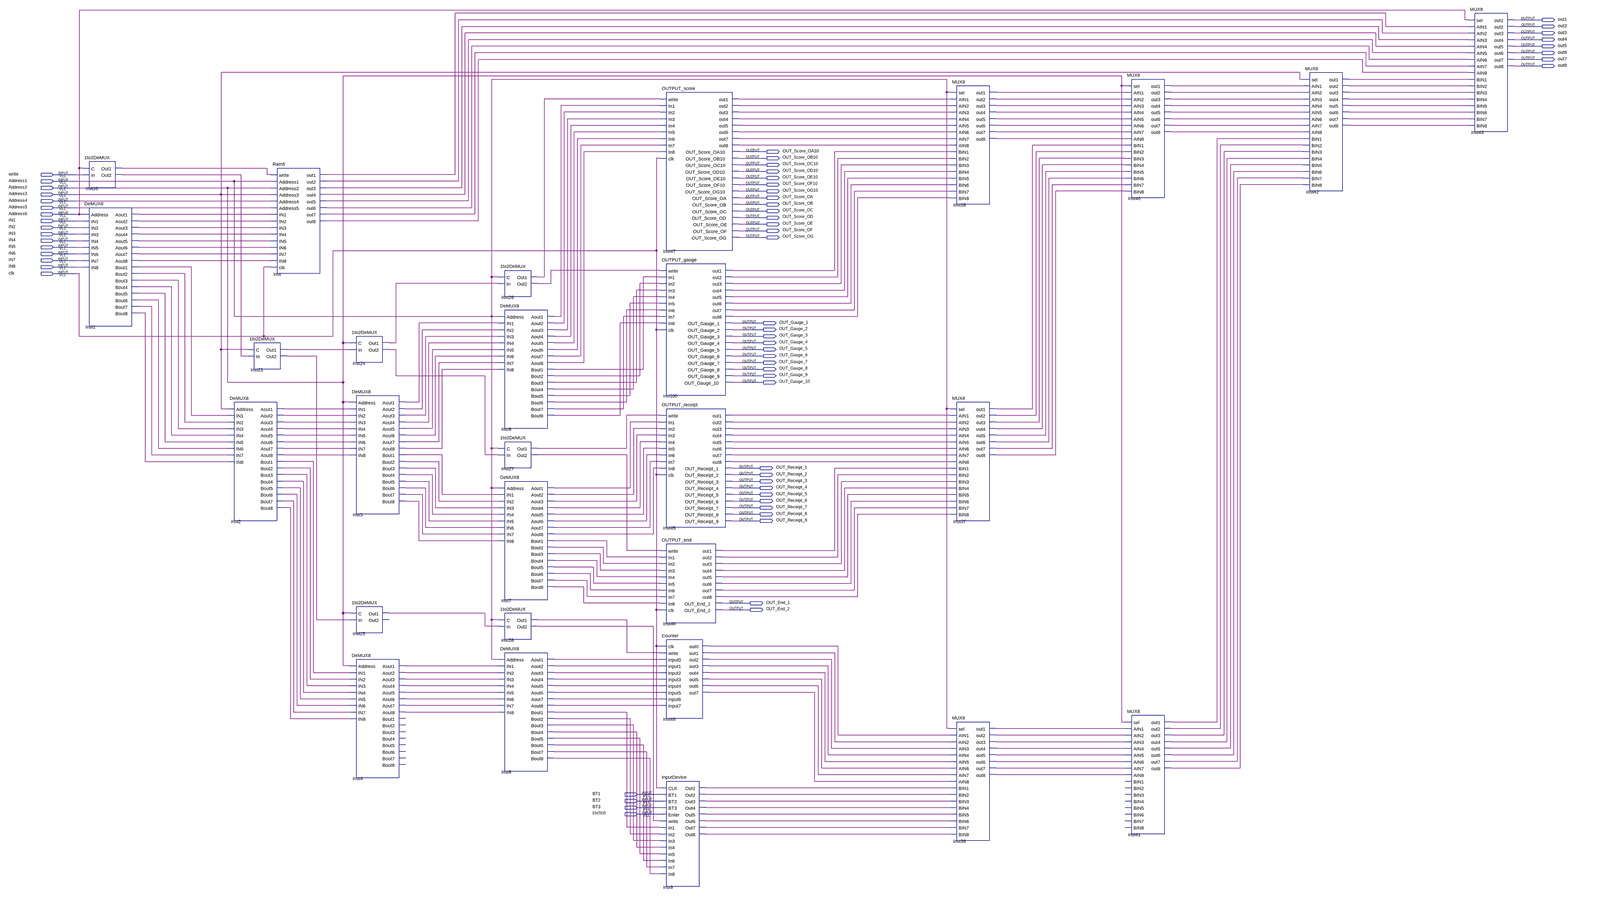
[diagram p0: schematic sheet, whole]
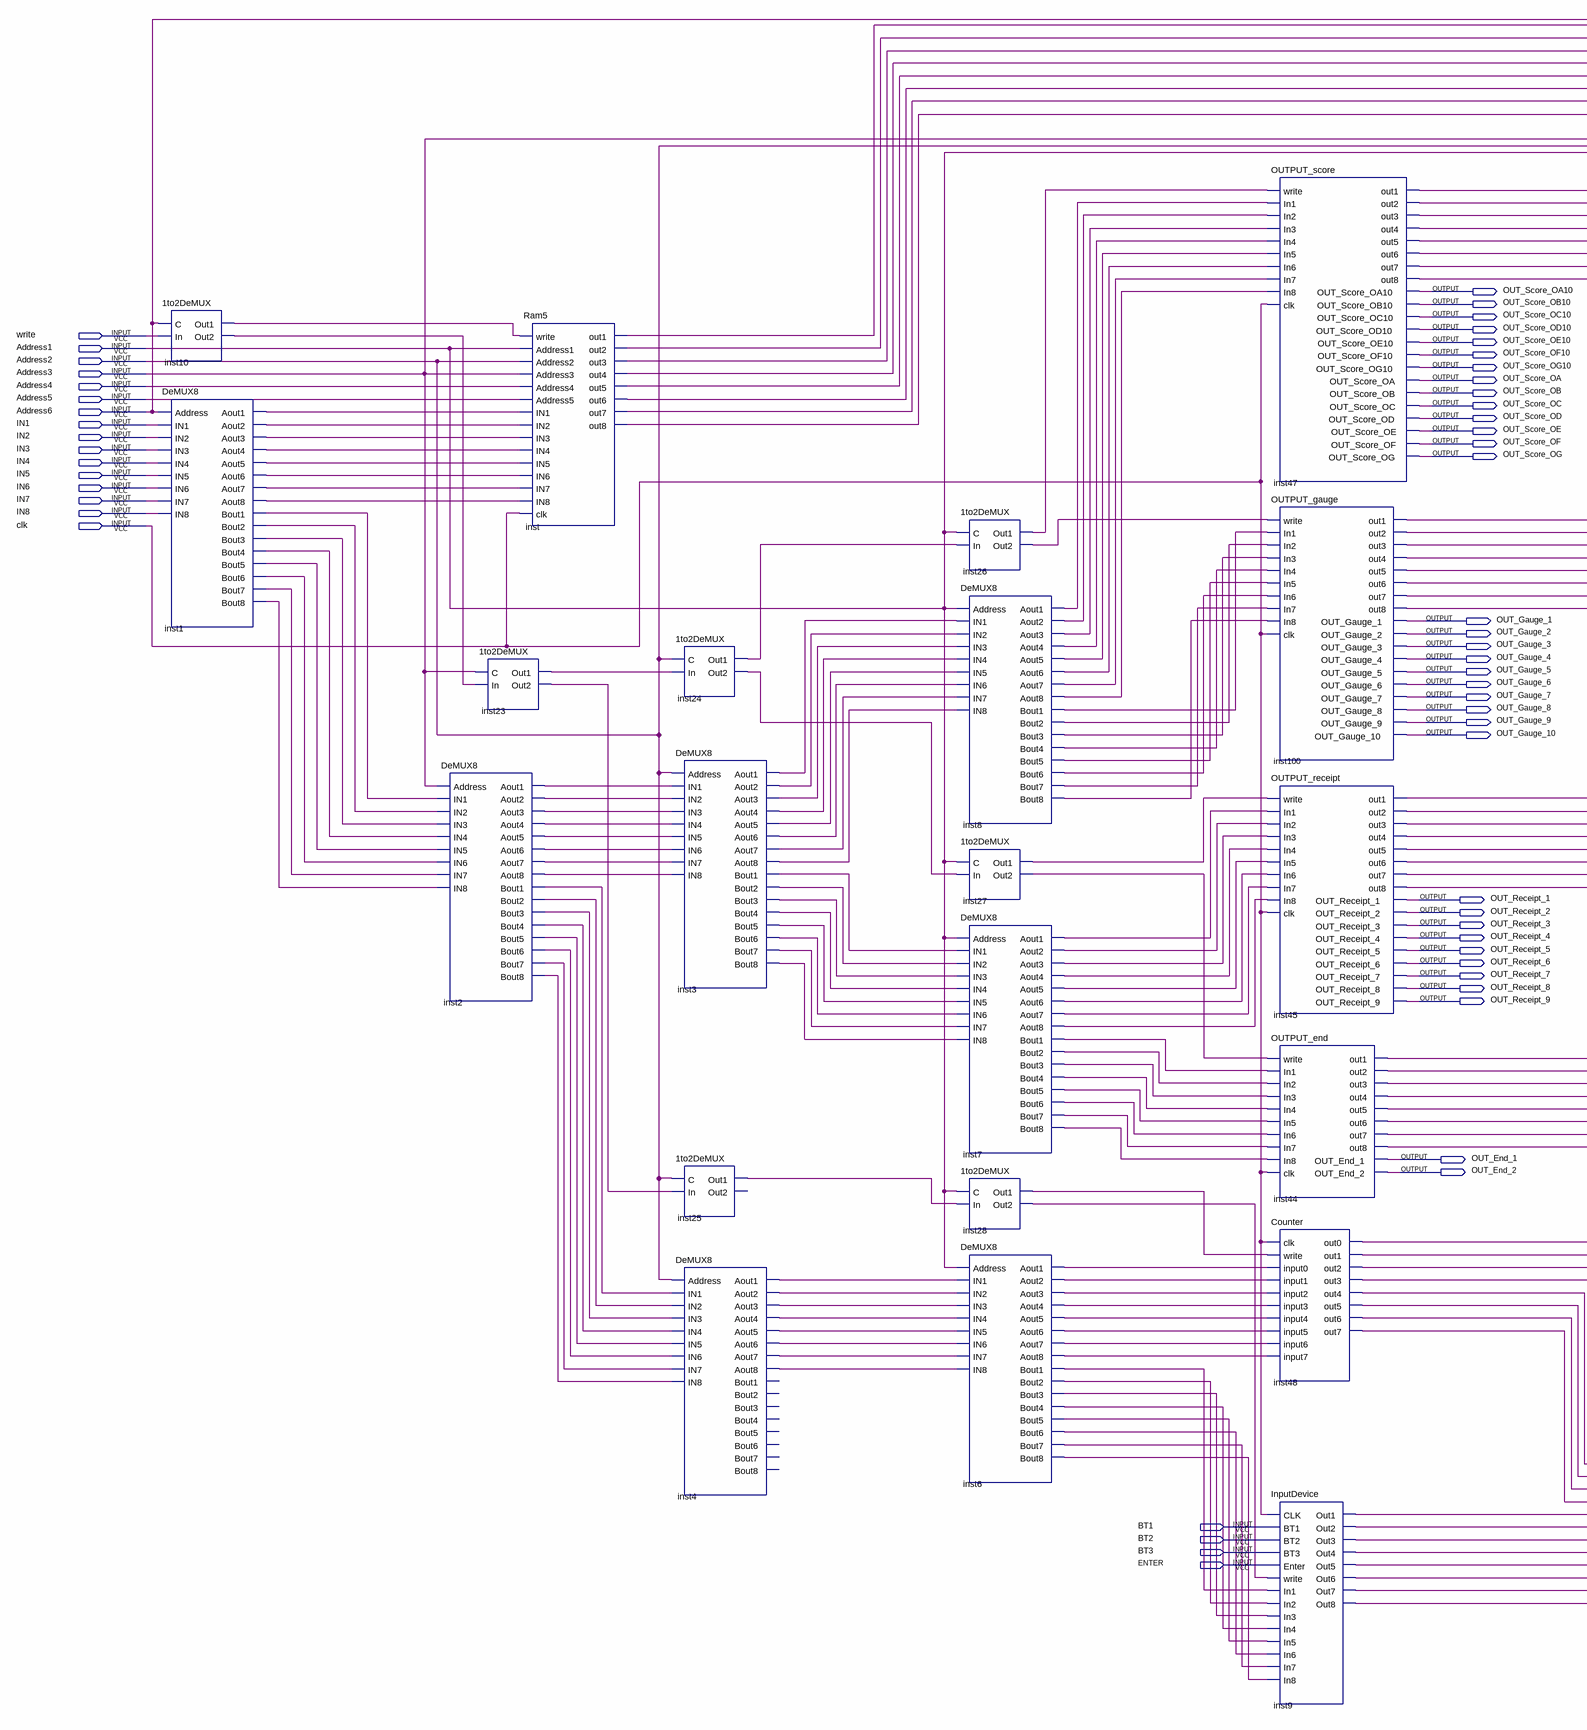
[diagram p1: schematic sheet, left part]
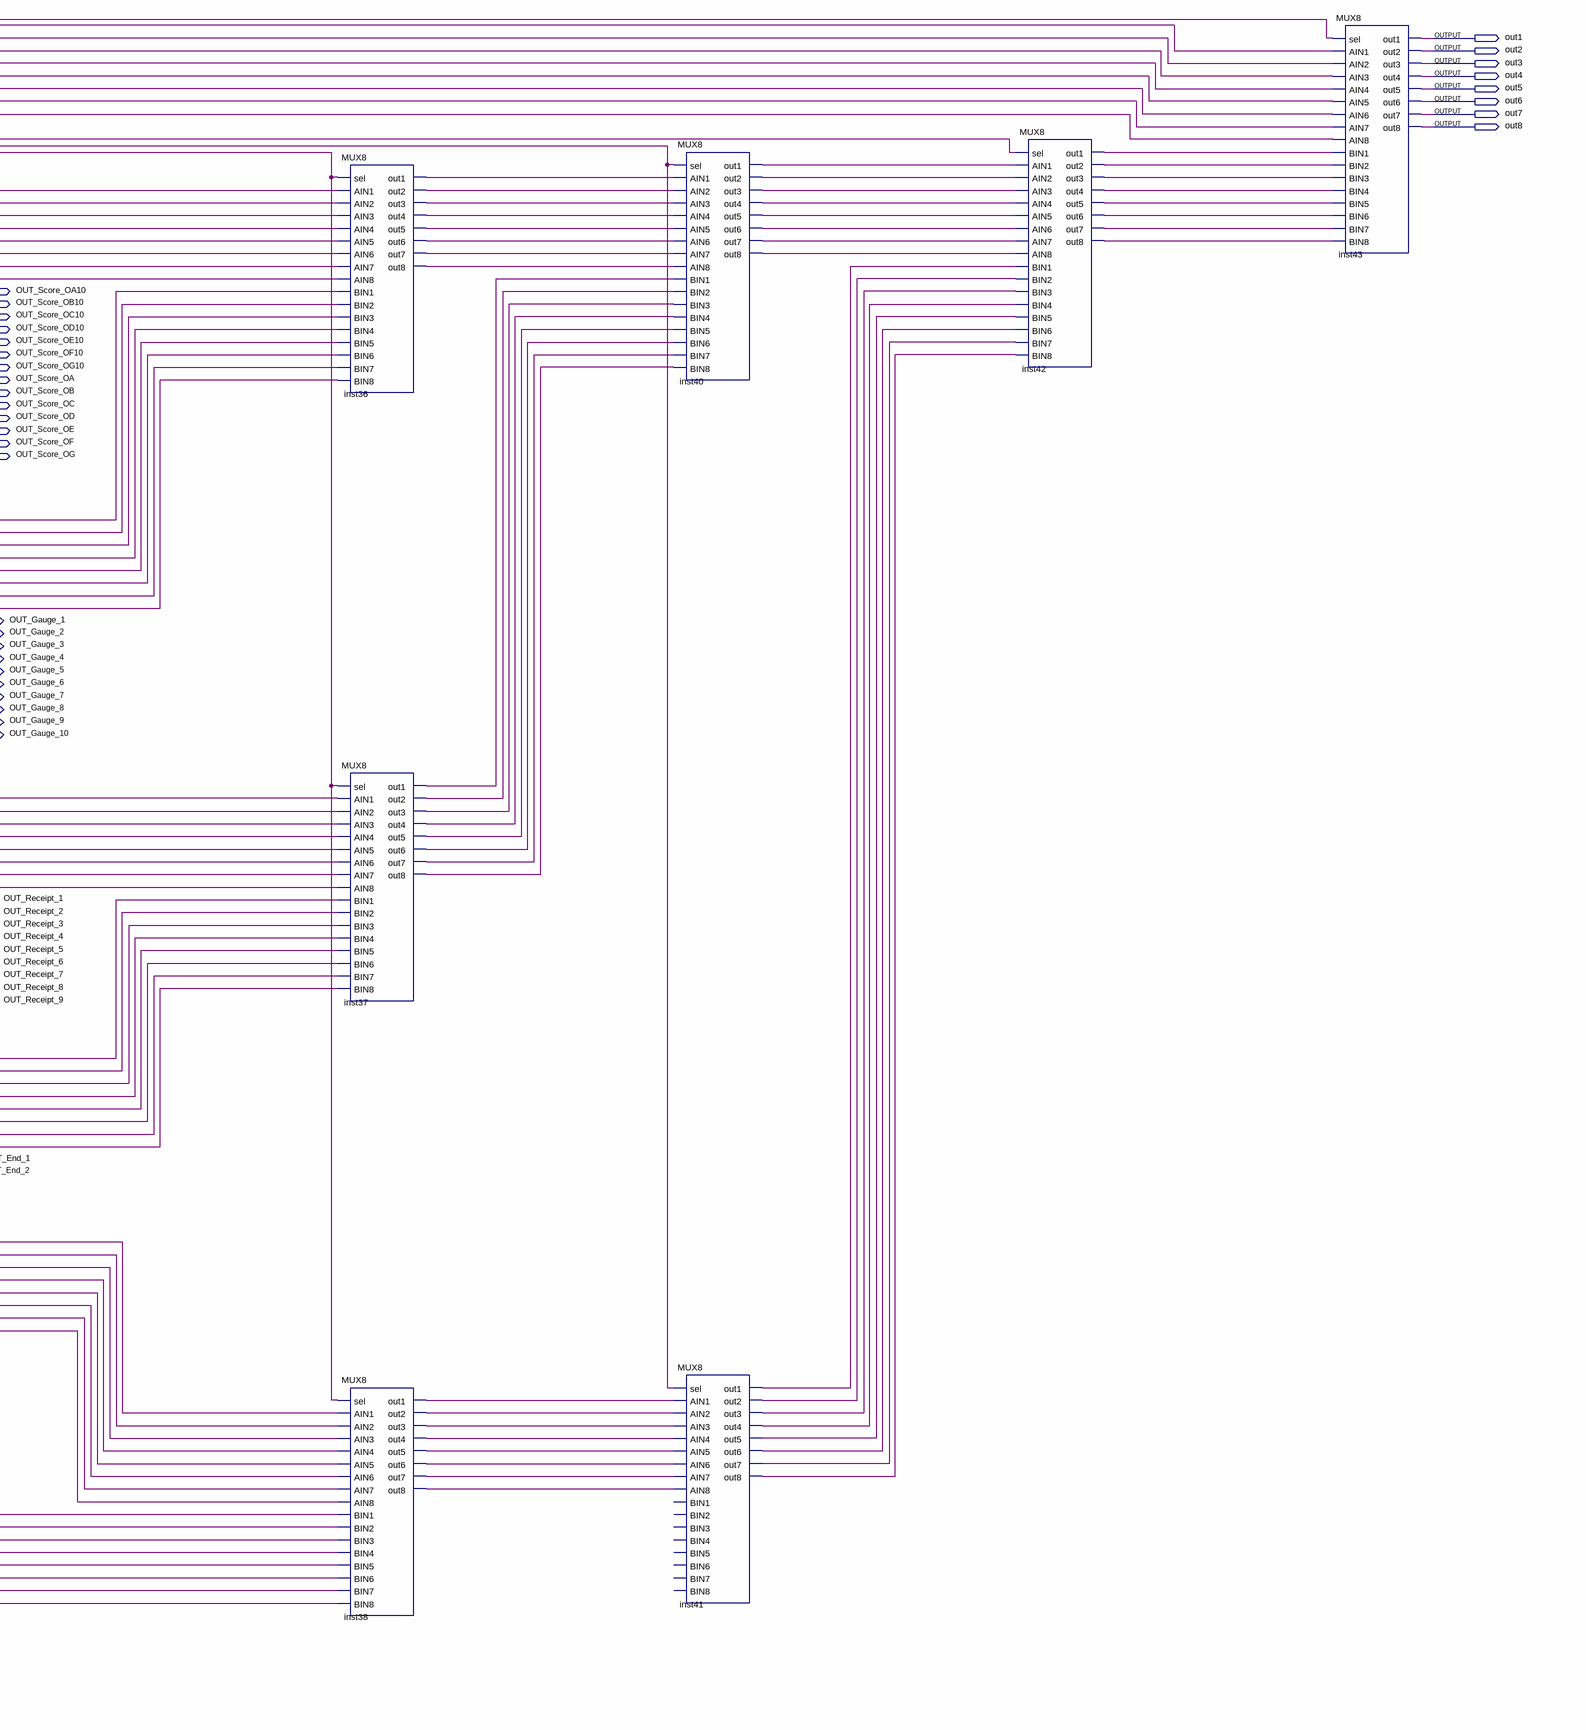
[diagram p2: schematic sheet, right part]
// Quartus schematic RAM.bdf as structural Verilog: 28 symbols, 63 pins
module RAM (
  input  write,
  input  Address1,
  input  Address2,
  input  Address3,
  input  Address4,
  input  Address5,
  input  Address6,
  input  IN1,
  input  IN2,
  input  IN3,
  input  IN4,
  input  IN5,
  input  IN6,
  input  IN7,
  input  IN8,
  input  clk,
  input  BT1,
  input  BT2,
  input  BT3,
  input  ENTER,
  output out1,
  output out2,
  output out3,
  output out4,
  output out5,
  output out6,
  output out7,
  output out8,
  output OUT_Score_OA10,
  output OUT_Score_OB10,
  output OUT_Score_OC10,
  output OUT_Score_OD10,
  output OUT_Score_OE10,
  output OUT_Score_OF10,
  output OUT_Score_OG10,
  output OUT_Score_OA,
  output OUT_Score_OB,
  output OUT_Score_OC,
  output OUT_Score_OD,
  output OUT_Score_OE,
  output OUT_Score_OF,
  output OUT_Score_OG,
  output OUT_Gauge_1,
  output OUT_Gauge_2,
  output OUT_Gauge_3,
  output OUT_Gauge_4,
  output OUT_Gauge_5,
  output OUT_Gauge_6,
  output OUT_Gauge_7,
  output OUT_Gauge_8,
  output OUT_Gauge_9,
  output OUT_Gauge_10,
  output OUT_Receipt_1,
  output OUT_Receipt_2,
  output OUT_Receipt_3,
  output OUT_Receipt_4,
  output OUT_Receipt_5,
  output OUT_Receipt_6,
  output OUT_Receipt_7,
  output OUT_Receipt_8,
  output OUT_Receipt_9,
  output OUT_End_1,
  output OUT_End_2
);

  wire inst1_aout1, inst1_aout2, inst1_aout3, inst1_aout4, inst1_aout5, inst1_aout6, inst1_aout7,
       inst1_aout8, inst1_bout1, inst1_bout2, inst1_bout3, inst1_bout4, inst1_bout5, inst1_bout6,
       inst1_bout7, inst1_bout8, inst2_aout1, inst2_aout2, inst2_aout3, inst2_aout4, inst2_aout5,
       inst2_aout6, inst2_aout7, inst2_aout8, inst2_bout1, inst2_bout2, inst2_bout3, inst2_bout4,
       inst2_bout5, inst2_bout6, inst2_bout7, inst2_bout8, inst3_aout1, inst3_aout2, inst3_aout3,
       inst3_aout4, inst3_aout5, inst3_aout6, inst3_aout7, inst3_aout8, inst3_bout1, inst3_bout2,
       inst3_bout3, inst3_bout4, inst3_bout5, inst3_bout6, inst3_bout7, inst3_bout8, inst4_aout1,
       inst4_aout2, inst4_aout3, inst4_aout4, inst4_aout5, inst4_aout6, inst4_aout7, inst4_aout8,
       inst6_aout1, inst6_aout2, inst6_aout3, inst6_aout4, inst6_aout5, inst6_aout6, inst6_aout7,
       inst6_aout8, inst6_bout1, inst6_bout2, inst6_bout3, inst6_bout4, inst6_bout5, inst6_bout6,
       inst6_bout7, inst6_bout8, inst7_aout1, inst7_aout2, inst7_aout3, inst7_aout4, inst7_aout5,
       inst7_aout6, inst7_aout7, inst7_aout8, inst7_bout1, inst7_bout2, inst7_bout3, inst7_bout4,
       inst7_bout5, inst7_bout6, inst7_bout7, inst7_bout8, inst8_aout1, inst8_aout2, inst8_aout3,
       inst8_aout4, inst8_aout5, inst8_aout6, inst8_aout7, inst8_aout8, inst8_bout1, inst8_bout2,
       inst8_bout3, inst8_bout4, inst8_bout5, inst8_bout6, inst8_bout7, inst8_bout8, inst9_out1, inst9_out2,
       inst9_out3, inst9_out4, inst9_out5, inst9_out6, inst9_out7, inst9_out8, inst10_out1, inst10_out2,
       inst23_out1, inst23_out2, inst24_out1, inst24_out2, inst25_out1, inst26_out1, inst26_out2,
       inst27_out1, inst27_out2, inst28_out1, inst28_out2, inst36_out1, inst36_out2, inst36_out3,
       inst36_out4, inst36_out5, inst36_out6, inst36_out7, inst36_out8, inst37_out1, inst37_out2,
       inst37_out3, inst37_out4, inst37_out5, inst37_out6, inst37_out7, inst37_out8, inst38_out1,
       inst38_out2, inst38_out3, inst38_out4, inst38_out5, inst38_out6, inst38_out7, inst38_out8,
       inst40_out1, inst40_out2, inst40_out3, inst40_out4, inst40_out5, inst40_out6, inst40_out7,
       inst40_out8, inst41_out1, inst41_out2, inst41_out3, inst41_out4, inst41_out5, inst41_out6,
       inst41_out7, inst41_out8, inst42_out1, inst42_out2, inst42_out3, inst42_out4, inst42_out5,
       inst42_out6, inst42_out7, inst42_out8, inst44_out1, inst44_out2, inst44_out3, inst44_out4,
       inst44_out5, inst44_out6, inst44_out7, inst44_out8, inst45_out1, inst45_out2, inst45_out3,
       inst45_out4, inst45_out5, inst45_out6, inst45_out7, inst45_out8, inst47_out1, inst47_out2,
       inst47_out3, inst47_out4, inst47_out5, inst47_out6, inst47_out7, inst47_out8, inst48_out0,
       inst48_out1, inst48_out2, inst48_out3, inst48_out4, inst48_out5, inst48_out6, inst48_out7,
       inst100_out1, inst100_out2, inst100_out3, inst100_out4, inst100_out5, inst100_out6, inst100_out7,
       inst100_out8, inst_out1, inst_out2, inst_out3, inst_out4, inst_out5, inst_out6, inst_out7, inst_out8;

  \1to2DeMUX  inst10 (.C(Address6), .In(write), .Out1(inst10_out1), .Out2(inst10_out2));
  DeMUX8 inst1 (
    .Address(Address6), .IN1(IN1), .IN2(IN2), .IN3(IN3), .IN4(IN4), .IN5(IN5), .IN6(IN6), .IN7(IN7),
    .IN8(IN8), .Aout1(inst1_aout1), .Aout2(inst1_aout2), .Aout3(inst1_aout3), .Aout4(inst1_aout4),
    .Aout5(inst1_aout5), .Aout6(inst1_aout6), .Aout7(inst1_aout7), .Aout8(inst1_aout8), .Bout1(inst1_bout1),
    .Bout2(inst1_bout2), .Bout3(inst1_bout3), .Bout4(inst1_bout4), .Bout5(inst1_bout5), .Bout6(inst1_bout6),
    .Bout7(inst1_bout7), .Bout8(inst1_bout8));
  DeMUX8 inst2 (
    .Address(Address3), .IN1(inst1_bout1), .IN2(inst1_bout2), .IN3(inst1_bout3), .IN4(inst1_bout4),
    .IN5(inst1_bout5), .IN6(inst1_bout6), .IN7(inst1_bout7), .IN8(inst1_bout8), .Aout1(inst2_aout1),
    .Aout2(inst2_aout2), .Aout3(inst2_aout3), .Aout4(inst2_aout4), .Aout5(inst2_aout5), .Aout6(inst2_aout6),
    .Aout7(inst2_aout7), .Aout8(inst2_aout8), .Bout1(inst2_bout1), .Bout2(inst2_bout2), .Bout3(inst2_bout3),
    .Bout4(inst2_bout4), .Bout5(inst2_bout5), .Bout6(inst2_bout6), .Bout7(inst2_bout7), .Bout8(inst2_bout8));
  \1to2DeMUX  inst23 (.C(Address3), .In(inst10_out2), .Out1(inst23_out1), .Out2(inst23_out2));
  Ram5 inst (
    .write(inst10_out1), .Address1(Address1), .Address2(Address2), .Address3(Address3), .Address4(Address4),
    .Address5(Address5), .IN1(inst1_aout1), .IN2(inst1_aout2), .IN3(inst1_aout3), .IN4(inst1_aout4),
    .IN5(inst1_aout5), .IN6(inst1_aout6), .IN7(inst1_aout7), .IN8(inst1_aout8), .clk(clk), .out1(inst_out1),
    .out2(inst_out2), .out3(inst_out3), .out4(inst_out4), .out5(inst_out5), .out6(inst_out6),
    .out7(inst_out7), .out8(inst_out8));
  \1to2DeMUX  inst24 (.C(Address2), .In(inst23_out1), .Out1(inst24_out1), .Out2(inst24_out2));
  DeMUX8 inst3 (
    .Address(Address2), .IN1(inst2_aout1), .IN2(inst2_aout2), .IN3(inst2_aout3), .IN4(inst2_aout4),
    .IN5(inst2_aout5), .IN6(inst2_aout6), .IN7(inst2_aout7), .IN8(inst2_aout8), .Aout1(inst3_aout1),
    .Aout2(inst3_aout2), .Aout3(inst3_aout3), .Aout4(inst3_aout4), .Aout5(inst3_aout5), .Aout6(inst3_aout6),
    .Aout7(inst3_aout7), .Aout8(inst3_aout8), .Bout1(inst3_bout1), .Bout2(inst3_bout2), .Bout3(inst3_bout3),
    .Bout4(inst3_bout4), .Bout5(inst3_bout5), .Bout6(inst3_bout6), .Bout7(inst3_bout7), .Bout8(inst3_bout8));
  \1to2DeMUX  inst25 (.C(Address2), .In(inst23_out2), .Out1(inst25_out1));  // open: Out2
  DeMUX8 inst4 (
    .Address(Address2), .IN1(inst2_bout1), .IN2(inst2_bout2), .IN3(inst2_bout3), .IN4(inst2_bout4),
    .IN5(inst2_bout5), .IN6(inst2_bout6), .IN7(inst2_bout7), .IN8(inst2_bout8), .Aout1(inst4_aout1),
    .Aout2(inst4_aout2), .Aout3(inst4_aout3), .Aout4(inst4_aout4), .Aout5(inst4_aout5), .Aout6(inst4_aout6),
    .Aout7(inst4_aout7), .Aout8(inst4_aout8));  // open: Bout1, Bout2, Bout3, Bout4, Bout5, Bout6, Bout7, Bout8
  \1to2DeMUX  inst26 (.C(Address1), .In(inst24_out1), .Out1(inst26_out1), .Out2(inst26_out2));
  DeMUX8 inst8 (
    .Address(Address1), .IN1(inst3_aout1), .IN2(inst3_aout2), .IN3(inst3_aout3), .IN4(inst3_aout4),
    .IN5(inst3_aout5), .IN6(inst3_aout6), .IN7(inst3_aout7), .IN8(inst3_aout8), .Aout1(inst8_aout1),
    .Aout2(inst8_aout2), .Aout3(inst8_aout3), .Aout4(inst8_aout4), .Aout5(inst8_aout5), .Aout6(inst8_aout6),
    .Aout7(inst8_aout7), .Aout8(inst8_aout8), .Bout1(inst8_bout1), .Bout2(inst8_bout2), .Bout3(inst8_bout3),
    .Bout4(inst8_bout4), .Bout5(inst8_bout5), .Bout6(inst8_bout6), .Bout7(inst8_bout7), .Bout8(inst8_bout8));
  \1to2DeMUX  inst27 (.C(Address1), .In(inst24_out2), .Out1(inst27_out1), .Out2(inst27_out2));
  DeMUX8 inst7 (
    .Address(Address1), .IN1(inst3_bout1), .IN2(inst3_bout2), .IN3(inst3_bout3), .IN4(inst3_bout4),
    .IN5(inst3_bout5), .IN6(inst3_bout6), .IN7(inst3_bout7), .IN8(inst3_bout8), .Aout1(inst7_aout1),
    .Aout2(inst7_aout2), .Aout3(inst7_aout3), .Aout4(inst7_aout4), .Aout5(inst7_aout5), .Aout6(inst7_aout6),
    .Aout7(inst7_aout7), .Aout8(inst7_aout8), .Bout1(inst7_bout1), .Bout2(inst7_bout2), .Bout3(inst7_bout3),
    .Bout4(inst7_bout4), .Bout5(inst7_bout5), .Bout6(inst7_bout6), .Bout7(inst7_bout7), .Bout8(inst7_bout8));
  \1to2DeMUX  inst28 (.C(Address1), .In(inst25_out1), .Out1(inst28_out1), .Out2(inst28_out2));
  DeMUX8 inst6 (
    .Address(Address1), .IN1(inst4_aout1), .IN2(inst4_aout2), .IN3(inst4_aout3), .IN4(inst4_aout4),
    .IN5(inst4_aout5), .IN6(inst4_aout6), .IN7(inst4_aout7), .IN8(inst4_aout8), .Aout1(inst6_aout1),
    .Aout2(inst6_aout2), .Aout3(inst6_aout3), .Aout4(inst6_aout4), .Aout5(inst6_aout5), .Aout6(inst6_aout6),
    .Aout7(inst6_aout7), .Aout8(inst6_aout8), .Bout1(inst6_bout1), .Bout2(inst6_bout2), .Bout3(inst6_bout3),
    .Bout4(inst6_bout4), .Bout5(inst6_bout5), .Bout6(inst6_bout6), .Bout7(inst6_bout7), .Bout8(inst6_bout8));
  OUTPUT_score inst47 (
    .write(inst26_out1), .In1(inst8_aout1), .In2(inst8_aout2), .In3(inst8_aout3), .In4(inst8_aout4),
    .In5(inst8_aout5), .In6(inst8_aout6), .In7(inst8_aout7), .In8(inst8_aout8), .clk(clk),
    .out1(inst47_out1), .out2(inst47_out2), .out3(inst47_out3), .out4(inst47_out4), .out5(inst47_out5),
    .out6(inst47_out6), .out7(inst47_out7), .out8(inst47_out8), .OUT_Score_OA10(OUT_Score_OA10),
    .OUT_Score_OB10(OUT_Score_OB10), .OUT_Score_OC10(OUT_Score_OC10), .OUT_Score_OD10(OUT_Score_OD10),
    .OUT_Score_OE10(OUT_Score_OE10), .OUT_Score_OF10(OUT_Score_OF10), .OUT_Score_OG10(OUT_Score_OG10),
    .OUT_Score_OA(OUT_Score_OA), .OUT_Score_OB(OUT_Score_OB), .OUT_Score_OC(OUT_Score_OC),
    .OUT_Score_OD(OUT_Score_OD), .OUT_Score_OE(OUT_Score_OE), .OUT_Score_OF(OUT_Score_OF),
    .OUT_Score_OG(OUT_Score_OG));
  OUTPUT_gauge inst100 (
    .write(inst26_out2), .In1(inst8_bout1), .In2(inst8_bout2), .In3(inst8_bout3), .In4(inst8_bout4),
    .In5(inst8_bout5), .In6(inst8_bout6), .In7(inst8_bout7), .In8(inst8_bout8), .clk(clk),
    .out1(inst100_out1), .out2(inst100_out2), .out3(inst100_out3), .out4(inst100_out4), .out5(inst100_out5),
    .out6(inst100_out6), .out7(inst100_out7), .out8(inst100_out8), .OUT_Gauge_1(OUT_Gauge_1),
    .OUT_Gauge_2(OUT_Gauge_2), .OUT_Gauge_3(OUT_Gauge_3), .OUT_Gauge_4(OUT_Gauge_4),
    .OUT_Gauge_5(OUT_Gauge_5), .OUT_Gauge_6(OUT_Gauge_6), .OUT_Gauge_7(OUT_Gauge_7),
    .OUT_Gauge_8(OUT_Gauge_8), .OUT_Gauge_9(OUT_Gauge_9), .OUT_Gauge_10(OUT_Gauge_10));
  OUTPUT_receipt inst45 (
    .write(inst27_out1), .In1(inst7_aout1), .In2(inst7_aout2), .In3(inst7_aout3), .In4(inst7_aout4),
    .In5(inst7_aout5), .In6(inst7_aout6), .In7(inst7_aout7), .In8(inst7_aout8), .clk(clk),
    .out1(inst45_out1), .out2(inst45_out2), .out3(inst45_out3), .out4(inst45_out4), .out5(inst45_out5),
    .out6(inst45_out6), .out7(inst45_out7), .out8(inst45_out8), .OUT_Receipt_1(OUT_Receipt_1),
    .OUT_Receipt_2(OUT_Receipt_2), .OUT_Receipt_3(OUT_Receipt_3), .OUT_Receipt_4(OUT_Receipt_4),
    .OUT_Receipt_5(OUT_Receipt_5), .OUT_Receipt_6(OUT_Receipt_6), .OUT_Receipt_7(OUT_Receipt_7),
    .OUT_Receipt_8(OUT_Receipt_8), .OUT_Receipt_9(OUT_Receipt_9));
  OUTPUT_end inst44 (
    .write(inst27_out2), .In1(inst7_bout1), .In2(inst7_bout2), .In3(inst7_bout3), .In4(inst7_bout4),
    .In5(inst7_bout5), .In6(inst7_bout6), .In7(inst7_bout7), .In8(inst7_bout8), .clk(clk),
    .out1(inst44_out1), .out2(inst44_out2), .out3(inst44_out3), .out4(inst44_out4), .out5(inst44_out5),
    .out6(inst44_out6), .out7(inst44_out7), .out8(inst44_out8), .OUT_End_1(OUT_End_1), .OUT_End_2(OUT_End_2));
  Counter inst48 (
    .clk(clk), .write(inst28_out1), .input0(inst6_aout1), .input1(inst6_aout2), .input2(inst6_aout3),
    .input3(inst6_aout4), .input4(inst6_aout5), .input5(inst6_aout6), .input6(inst6_aout7),
    .input7(inst6_aout8), .out0(inst48_out0), .out1(inst48_out1), .out2(inst48_out2), .out3(inst48_out3),
    .out4(inst48_out4), .out5(inst48_out5), .out6(inst48_out6), .out7(inst48_out7));
  InputDevice inst9 (
    .CLK(clk), .BT1(BT1), .BT2(BT2), .BT3(BT3), .Enter(ENTER), .write(inst28_out2), .In1(inst6_bout1),
    .In2(inst6_bout2), .In3(inst6_bout3), .In4(inst6_bout4), .In5(inst6_bout5), .In6(inst6_bout6),
    .In7(inst6_bout7), .In8(inst6_bout8), .Out1(inst9_out1), .Out2(inst9_out2), .Out3(inst9_out3),
    .Out4(inst9_out4), .Out5(inst9_out5), .Out6(inst9_out6), .Out7(inst9_out7), .Out8(inst9_out8));
  MUX8 inst36 (
    .sel(Address1), .AIN1(inst47_out1), .AIN2(inst47_out2), .AIN3(inst47_out3), .AIN4(inst47_out4),
    .AIN5(inst47_out5), .AIN6(inst47_out6), .AIN7(inst47_out7), .AIN8(inst47_out8), .BIN1(inst100_out1),
    .BIN2(inst100_out2), .BIN3(inst100_out3), .BIN4(inst100_out4), .BIN5(inst100_out5), .BIN6(inst100_out6),
    .BIN7(inst100_out7), .BIN8(inst100_out8), .out1(inst36_out1), .out2(inst36_out2), .out3(inst36_out3),
    .out4(inst36_out4), .out5(inst36_out5), .out6(inst36_out6), .out7(inst36_out7), .out8(inst36_out8));
  MUX8 inst37 (
    .sel(Address1), .AIN1(inst45_out1), .AIN2(inst45_out2), .AIN3(inst45_out3), .AIN4(inst45_out4),
    .AIN5(inst45_out5), .AIN6(inst45_out6), .AIN7(inst45_out7), .AIN8(inst45_out8), .BIN1(inst44_out1),
    .BIN2(inst44_out2), .BIN3(inst44_out3), .BIN4(inst44_out4), .BIN5(inst44_out5), .BIN6(inst44_out6),
    .BIN7(inst44_out7), .BIN8(inst44_out8), .out1(inst37_out1), .out2(inst37_out2), .out3(inst37_out3),
    .out4(inst37_out4), .out5(inst37_out5), .out6(inst37_out6), .out7(inst37_out7), .out8(inst37_out8));
  MUX8 inst38 (
    .sel(Address1), .AIN1(inst48_out0), .AIN2(inst48_out1), .AIN3(inst48_out2), .AIN4(inst48_out3),
    .AIN5(inst48_out4), .AIN6(inst48_out5), .AIN7(inst48_out6), .AIN8(inst48_out7), .BIN1(inst9_out1),
    .BIN2(inst9_out2), .BIN3(inst9_out3), .BIN4(inst9_out4), .BIN5(inst9_out5), .BIN6(inst9_out6),
    .BIN7(inst9_out7), .BIN8(inst9_out8), .out1(inst38_out1), .out2(inst38_out2), .out3(inst38_out3),
    .out4(inst38_out4), .out5(inst38_out5), .out6(inst38_out6), .out7(inst38_out7), .out8(inst38_out8));
  MUX8 inst40 (
    .sel(Address2), .AIN1(inst36_out1), .AIN2(inst36_out2), .AIN3(inst36_out3), .AIN4(inst36_out4),
    .AIN5(inst36_out5), .AIN6(inst36_out6), .AIN7(inst36_out7), .AIN8(inst36_out8), .BIN1(inst37_out1),
    .BIN2(inst37_out2), .BIN3(inst37_out3), .BIN4(inst37_out4), .BIN5(inst37_out5), .BIN6(inst37_out6),
    .BIN7(inst37_out7), .BIN8(inst37_out8), .out1(inst40_out1), .out2(inst40_out2), .out3(inst40_out3),
    .out4(inst40_out4), .out5(inst40_out5), .out6(inst40_out6), .out7(inst40_out7), .out8(inst40_out8));
  MUX8 inst41 (
    .sel(Address2), .AIN1(inst38_out1), .AIN2(inst38_out2), .AIN3(inst38_out3), .AIN4(inst38_out4),
    .AIN5(inst38_out5), .AIN6(inst38_out6), .AIN7(inst38_out7), .AIN8(inst38_out8), .out1(inst41_out1),
    .out2(inst41_out2), .out3(inst41_out3), .out4(inst41_out4), .out5(inst41_out5), .out6(inst41_out6),
    .out7(inst41_out7), .out8(inst41_out8));  // open: BIN1, BIN2, BIN3, BIN4, BIN5, BIN6, BIN7, BIN8
  MUX8 inst42 (
    .sel(Address3), .AIN1(inst40_out1), .AIN2(inst40_out2), .AIN3(inst40_out3), .AIN4(inst40_out4),
    .AIN5(inst40_out5), .AIN6(inst40_out6), .AIN7(inst40_out7), .AIN8(inst40_out8), .BIN1(inst41_out1),
    .BIN2(inst41_out2), .BIN3(inst41_out3), .BIN4(inst41_out4), .BIN5(inst41_out5), .BIN6(inst41_out6),
    .BIN7(inst41_out7), .BIN8(inst41_out8), .out1(inst42_out1), .out2(inst42_out2), .out3(inst42_out3),
    .out4(inst42_out4), .out5(inst42_out5), .out6(inst42_out6), .out7(inst42_out7), .out8(inst42_out8));
  MUX8 inst43 (
    .sel(Address6), .AIN1(inst_out1), .AIN2(inst_out2), .AIN3(inst_out3), .AIN4(inst_out4), .AIN5(inst_out5),
    .AIN6(inst_out6), .AIN7(inst_out7), .AIN8(inst_out8), .BIN1(inst42_out1), .BIN2(inst42_out2),
    .BIN3(inst42_out3), .BIN4(inst42_out4), .BIN5(inst42_out5), .BIN6(inst42_out6), .BIN7(inst42_out7),
    .BIN8(inst42_out8), .out1(out1), .out2(out2), .out3(out3), .out4(out4), .out5(out5), .out6(out6),
    .out7(out7), .out8(out8));
endmodule
